# EAGLE design accelerometerV2 (EAGLE 5.10)
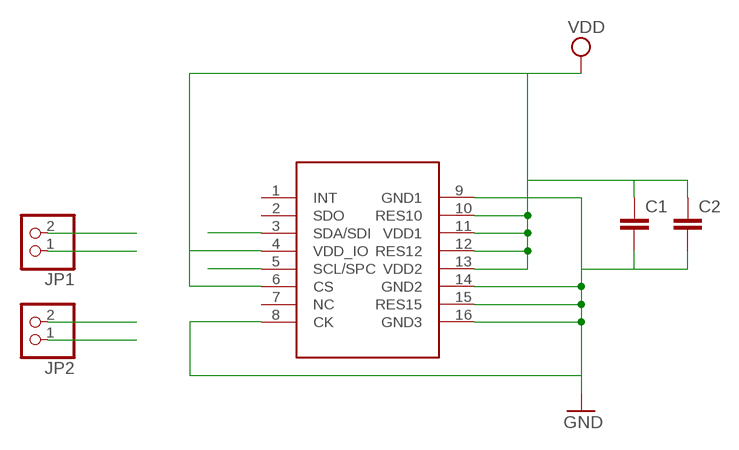
[diagram p0: schematic, sheet 1]

## Parts
C1  C-EUC0805  [C0805]
C2  C-EUC0805  [C0805]
JP1  PINHD-1X2  [1X02]
JP2  PINHD-1X2  [1X02]
U$1  LIS3LV02DL  [LGA16-7.5X4.4]

## Nets
GND: C1.2 C2.2 JP1.1 U$1.8(CK) U$1.9(GND1) U$1.14(GND2) U$1.15(RES15) U$1.16(GND3)
SCL: JP2.1 U$1.5(SCL/SPC)
SDA: JP2.2 U$1.3(SDA/SDI)
VDD: C1.1 C2.1 JP1.2 U$1.4(VDD_IO) U$1.6(CS) U$1.10(RES10) U$1.11(VDD1) U$1.12(RES12) U$1.13(VDD2)
Unconnected: U$1.1(INT) U$1.2(SDO) U$1.7(NC)

## Library data of the parts
C1 C2 = rcl:C-EU: CAPACITOR, European symbol
JP1 JP2 = pinhead:PINHD-1X2: PIN HEADER
U$1 = LIS3LV02DL:LIS3LV02DL

## Board
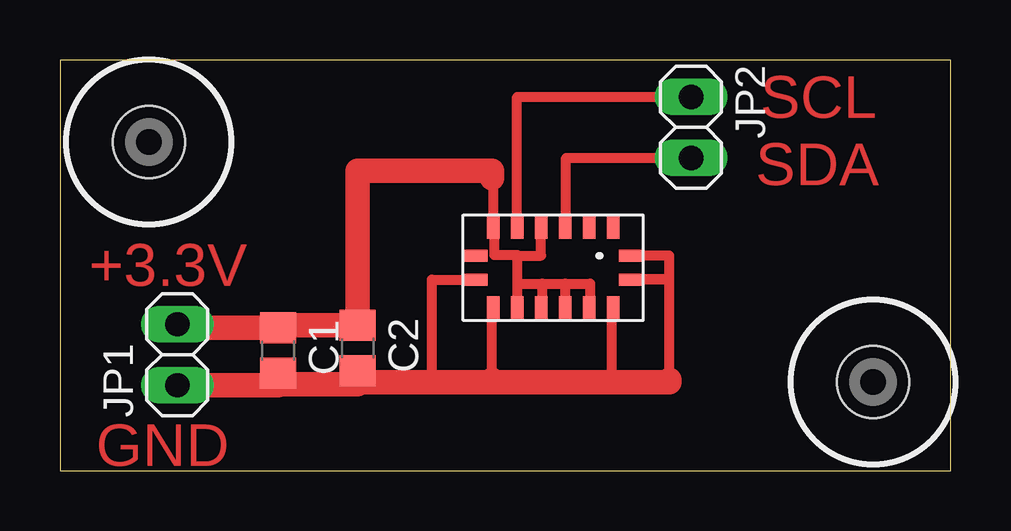
[diagram p1: board, top side]

Size 37.14 x 17.12 mm. Coordinates in mm from the lower left corner, seen from the top.
Outline: 0,0 37.14,0 37.14,17.12 0,17.12 0,0
Copper layers (1*16): Top 0.035mm / dielectric 1.5mm / Bottom 0.035mm
Design rules "default": minimum track width 10mil, minimum drill 24mil, track to track 8mil, track to pad 8mil, pad to pad 8mil, via to via 8mil, smd to smd 8mil, copper to edge 40mil, drill to drill 8mil, minimum pad ring 10mil, minimum via ring 8mil, stop-mask expansion 4mil, vias tented up to drill 0mil, thermal gap 10mil

### Footprints (pad centres in the part's own frame; a part is rotated, then mirrored left to right if it is on the bottom)
C0805 = smd 1.3 x 1.5: 1 -0.95,0; 2 0.95,0
1X02 = drill 1.016 long: 1 -1.27,0; 2 1.27,0
LGA16-7.5X4.4 = smd 0.508 x 1.016: 1 6.25,3.9; 2 5.25,3.9; 3 4.25,3.9; 4 3.25,3.9; 5 2.25,3.9; 6 1.25,3.9; 9 1.25,0.5; 10 2.25,0.5; 11 3.25,0.5; 12 4.25,0.5; 13 5.25,0.5; 14 6.25,0.5 | smd 1.016 x 0.508: 7 0.5,2.7; 8 0.5,1.7; 15 7,1.7; 16 7,2.7
DRIL-3 = hole 3: 0,0

### Placement (x,y rotation side)
C1  9.09,5.02 270 top
C2  12.41,5.12 270 top
JP1  4.89,4.84 90 top
JP2  26.31,14.31 270 top
U$1  16.81,6.27 0 top
U$2  [DRIL-3]  3.7,13.7 0 top
U$3  [DRIL-3]  33.9,3.7 0 top

### Tracks (layer width: path | path; a pad name or v marks a point on that pad's centre or on a via)
GND
  Top 0.406: U$1.16 25.4,8.97 25.4,8 23.81,8 U$1.15 25.4,7.97 25.4,3.8 25.4,3.4 | U$1.14 23,6.77 23,3.7 | 18,3.7 18,3.5 | U$1.9 18,6.77 18,3.8 | U$1.8 15.5,7.97 15.5,3.7
  Top 1.016: JP1.1 9.09,3.57 C1.2 9.1,3.6 12.41,3.6 C2.2 12.4,3.7 15.5,3.7 18,3.7 | 18,3.7 18,3.8 | 18,3.7 23,3.7 25.4,3.7 25.4,3.8
N$1  (via drill 0.6 pad 1.42)
  other vias: 3.7,13.7
N$2  (via drill 0.6 pad 1.42)
  other vias: 33.9,3.7
SCL
  Top 0.406: JP2.1 19.06,15.58 U$1.5
SDA
  Top 0.406: U$1.3 21.1,10.17 21.1,13.04 JP2.2
VDD
  Top 0.406: 19.06,8.97 19.06,7.8 | 19.06,7.8 U$1.10 | U$1.13 22.1,6.77 22.1,7.8 21.06,7.8 | 21.06,7.8 U$1.12 | 20.1,7.8 21.06,7.8 | U$1.11 20.1,6.77 20.1,7.8 | 19.06,7.8 20.1,7.8 | 19.06,8.97 20.06,8.97 U$1.4 | 19.06,8.97 19.06,9 18.1,9 18.1,10.17 U$1.6 18.06,12.2 18,12.2
  Top 1.016: JP1.2 4.89,5.97 C1.1 9.09,6.07 C2.1 12.41,8.9 12.4,8.9 12.4,12.5 18,12.5 18,12.2

### Text on the board
Top: SCL | SDA | +3.3V | GND